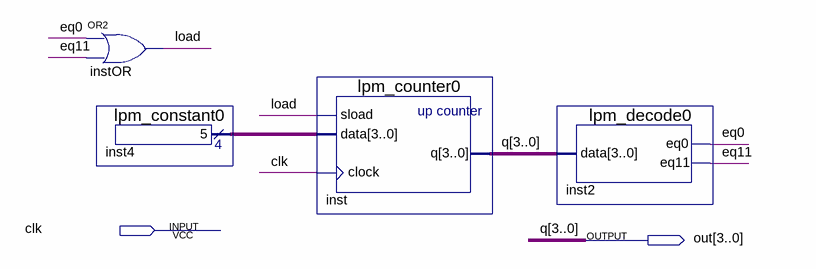
[diagram p0: schematic sheet]
// Quartus schematic laab7.bdf as structural Verilog: 4 symbols, 2 pins
module laab7 (
  input  clk,
  output [3:0] out
);

  wire eq0, eq11, load;
  wire [3:0] inst4_result;

  or instOR (load, eq0, eq11);
  lpm_constant0 inst4 (.result(inst4_result));
  lpm_counter0 inst (.sload(load), .data(inst4_result), .clock(clk), .q(out));
  lpm_decode0 inst2 (.data(out), .eq0(eq0), .eq11(eq11));

  // Other names for the same wires on the sheet: q[3:0] = out
endmodule
